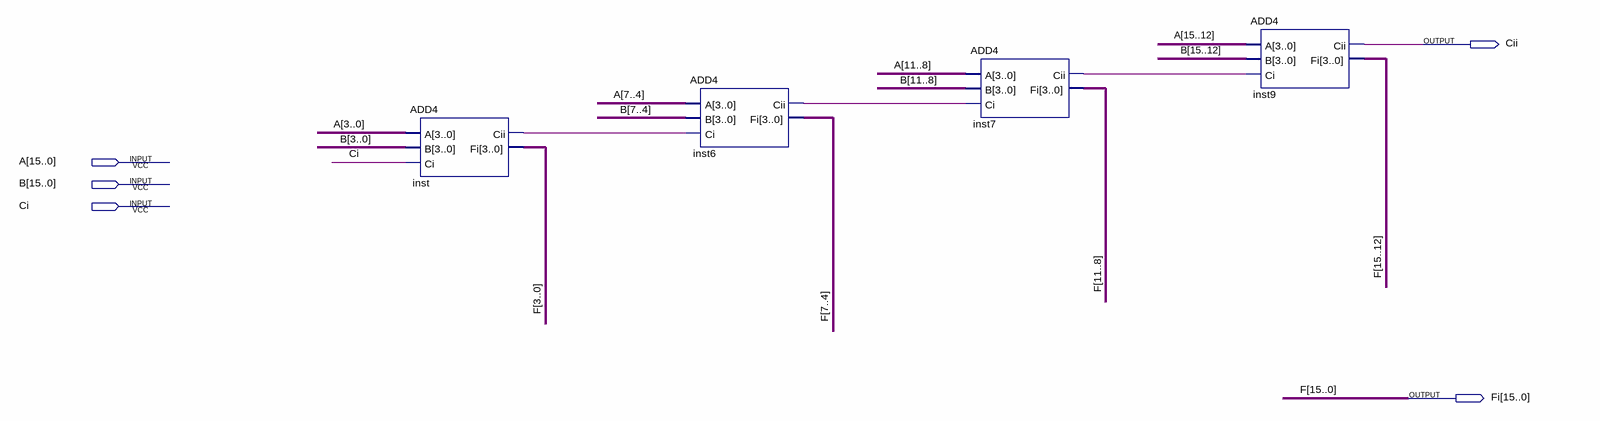
[diagram p0: schematic sheet]
// Quartus schematic ADD16.bdf as structural Verilog: 4 symbols, 5 pins
module ADD16 (
  input  [15:0] A,
  input  [15:0] B,
  input  Ci,
  output Cii,
  output [15:0] Fi
);

  wire inst6_cii, inst7_cii, inst_cii;

  ADD4 inst (.A(A[3:0]), .B(B[3:0]), .Ci(Ci), .Cii(inst_cii), .Fi(Fi[3:0]));
  ADD4 inst6 (.A(A[7:4]), .B(B[7:4]), .Ci(inst_cii), .Cii(inst6_cii), .Fi(Fi[7:4]));
  ADD4 inst7 (.A(A[11:8]), .B(B[11:8]), .Ci(inst6_cii), .Cii(inst7_cii), .Fi(Fi[11:8]));
  ADD4 inst9 (.A(A[15:12]), .B(B[15:12]), .Ci(inst7_cii), .Cii(Cii), .Fi(Fi[15:12]));

  // Other names for the same wires on the sheet: F[15:0] = Fi
endmodule
